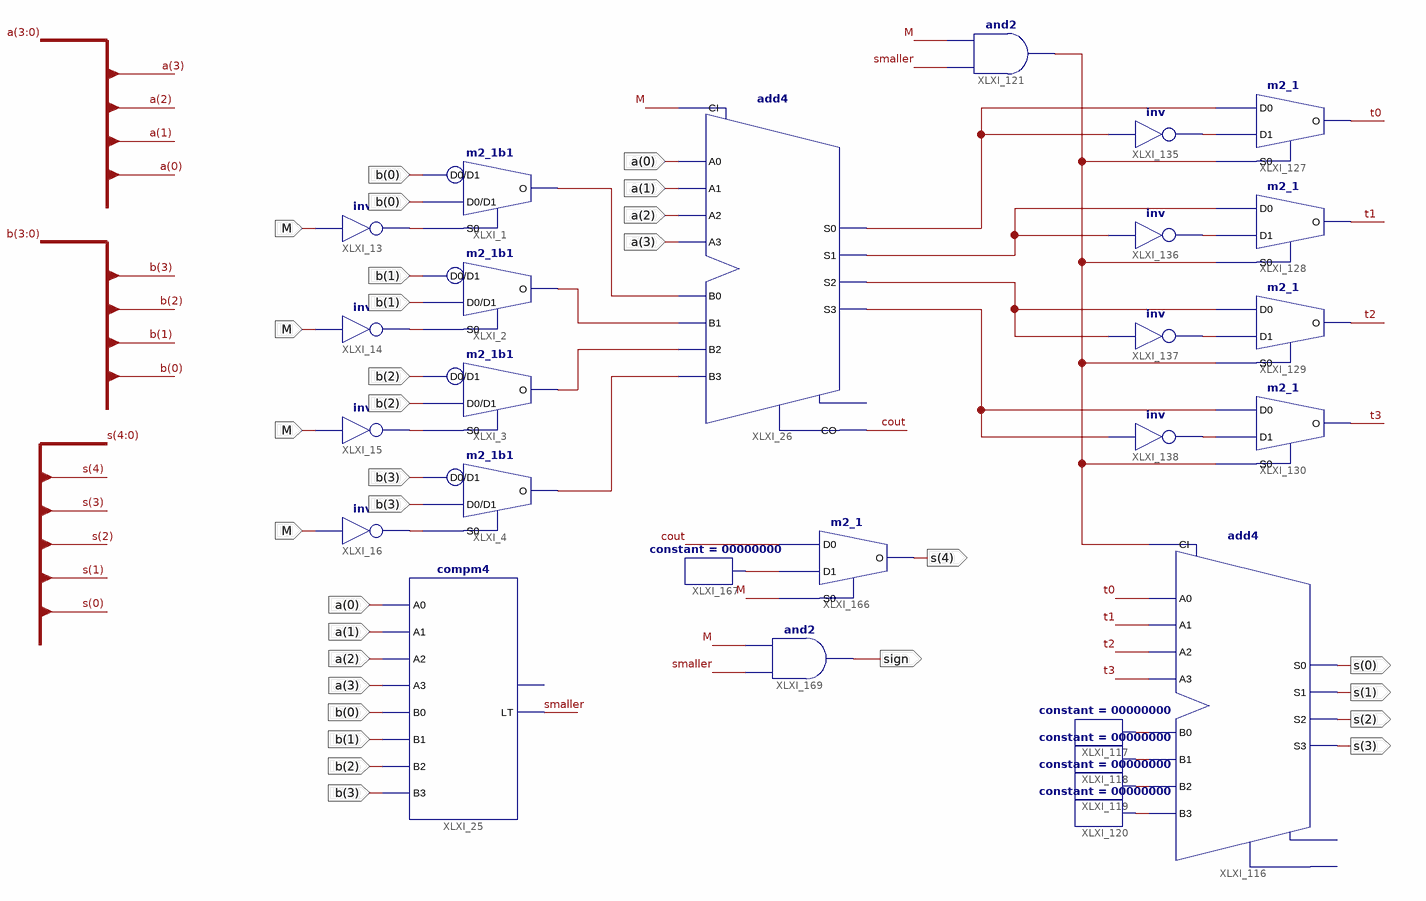
[diagram p0: schematic sheet 1]
// Xilinx ISE schematic add_sub.sch (xc9500) as structural Verilog: 27 symbols, 15 ports
module add_sub (
  input  [3:0] a,
  input  [3:0] b,
  input  M,
  output [4:0] s,
  output sign
);

  wire cout, smaller, t0, t1, t2, t3, XLXN_38, XLXN_39, XLXN_40, XLXN_41, XLXN_68, XLXN_69, XLXN_72, XLXN_73,
       XLXN_300, XLXN_301, XLXN_302, XLXN_303, XLXN_324, XLXN_325, XLXN_326, XLXN_327, XLXN_354, XLXN_355,
       XLXN_361, XLXN_362, XLXN_374, XLXN_413;

  m2_1b1 XLXI_1 (.D0(b[0]), .D1(b[0]), .S0(XLXN_38), .O(XLXN_68));
  m2_1b1 XLXI_2 (.D0(b[1]), .D1(b[1]), .S0(XLXN_39), .O(XLXN_69));
  m2_1b1 XLXI_3 (.D0(b[2]), .D1(b[2]), .S0(XLXN_40), .O(XLXN_72));
  m2_1b1 XLXI_4 (.D0(b[3]), .D1(b[3]), .S0(XLXN_41), .O(XLXN_73));
  not XLXI_16 (XLXN_41, M);
  not XLXI_15 (XLXN_40, M);
  not XLXI_14 (XLXN_39, M);
  not XLXI_13 (XLXN_38, M);
  compm4 XLXI_25 (
    .A0(a[0]), .A1(a[1]), .A2(a[2]), .A3(a[3]), .B0(b[0]), .B1(b[1]), .B2(b[2]), .B3(b[3]), .LT(smaller));  // open: GT
  add4 XLXI_26 (
    .A0(a[0]), .A1(a[1]), .A2(a[2]), .A3(a[3]), .B0(XLXN_68), .B1(XLXN_69), .B2(XLXN_72), .B3(XLXN_73),
    .CI(M), .CO(cout), .S0(XLXN_361), .S1(XLXN_362), .S2(XLXN_354), .S3(XLXN_355));  // open: OFL
  and XLXI_121 (XLXN_413, smaller, M);
  m2_1 XLXI_127 (.D0(XLXN_361), .D1(XLXN_324), .S0(XLXN_413), .O(t0));
  m2_1 XLXI_128 (.D0(XLXN_362), .D1(XLXN_325), .S0(XLXN_413), .O(t1));
  m2_1 XLXI_129 (.D0(XLXN_354), .D1(XLXN_326), .S0(XLXN_413), .O(t2));
  m2_1 XLXI_130 (.D0(XLXN_355), .D1(XLXN_327), .S0(XLXN_413), .O(t3));
  not XLXI_135 (XLXN_324, XLXN_361);
  not XLXI_136 (XLXN_325, XLXN_362);
  not XLXI_137 (XLXN_326, XLXN_354);
  not XLXI_138 (XLXN_327, XLXN_355);
  m2_1 XLXI_166 (.D0(cout), .D1(XLXN_374), .S0(M), .O(s[4]));
  constant #(.CValue("00000000")) XLXI_167 (.O(XLXN_374));
  constant #(.CValue("00000000")) XLXI_117 (.O(XLXN_300));
  constant #(.CValue("00000000")) XLXI_118 (.O(XLXN_301));
  constant #(.CValue("00000000")) XLXI_119 (.O(XLXN_302));
  constant #(.CValue("00000000")) XLXI_120 (.O(XLXN_303));
  add4 XLXI_116 (
    .A0(t0), .A1(t1), .A2(t2), .A3(t3), .B0(XLXN_300), .B1(XLXN_301), .B2(XLXN_302), .B3(XLXN_303),
    .CI(XLXN_413), .S0(s[0]), .S1(s[1]), .S2(s[2]), .S3(s[3]));  // open: CO, OFL
  and XLXI_169 (sign, smaller, M);
endmodule
